# EAGLE design EthernetBoardPanel (EAGLE 6.1)
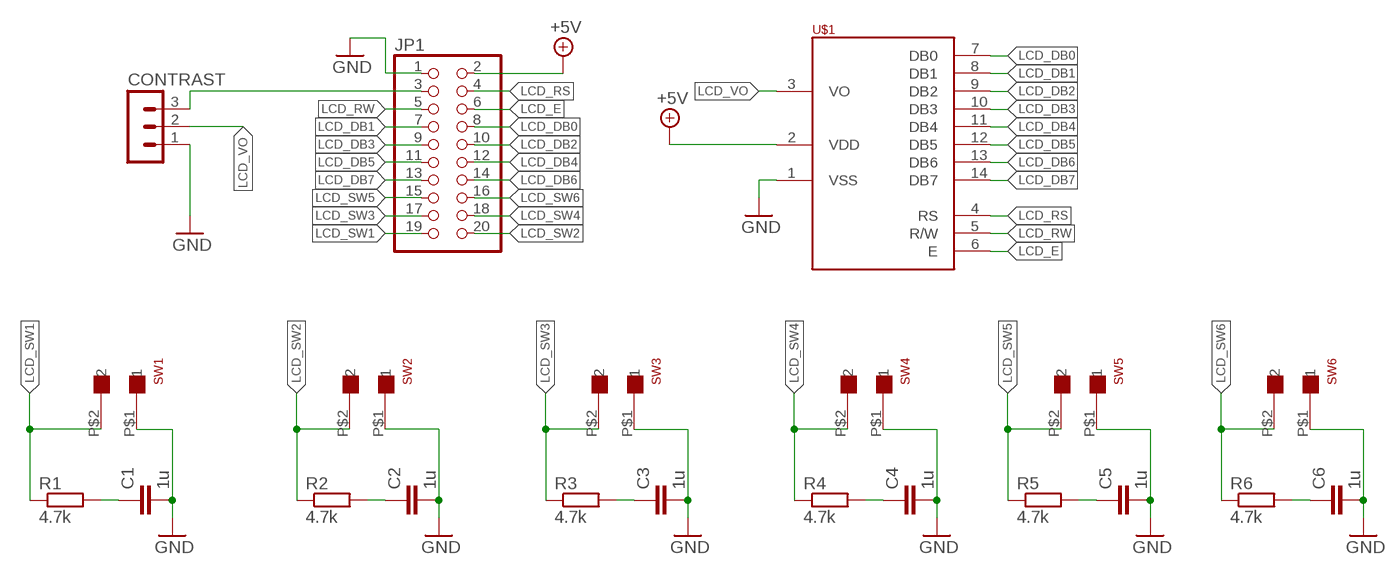
[diagram p0: schematic, sheet 1]

## Parts
C1  1u  C-EU025-025X050  [C025-025X050]
C2  1u  C-EU025-025X050  [C025-025X050]
C3  1u  C-EU025-025X050  [C025-025X050]
C4  1u  C-EU025-025X050  [C025-025X050]
C5  1u  C-EU025-025X050  [C025-025X050]
C6  1u  C-EU025-025X050  [C025-025X050]
CONTRAST  MA03-1  [MA03-1]
JP1  PINHD-2X10  [2X10]
R1  4.7k  R-EU_0204/7  [0204/7]
R2  4.7k  R-EU_0204/7  [0204/7]
R3  4.7k  R-EU_0204/7  [0204/7]
R4  4.7k  R-EU_0204/7  [0204/7]
R5  4.7k  R-EU_0204/7  [0204/7]
R6  4.7k  R-EU_0204/7  [0204/7]
SW1  XH-2  [XH-2]
SW2  XH-2  [XH-2]
SW3  XH-2  [XH-2]
SW4  XH-2  [XH-2]
SW5  XH-2  [XH-2]
SW6  XH-2  [XH-2]
U$1  SC2004  [SC2004]

## Nets
+5V [supply_5v]: JP1.2 U$1.2(VDD)
GND [gnd]: C1.2 C2.2 C3.2 C4.2 C5.2 C6.2 CONTRAST.1 JP1.1 SW1.P$1 SW2.P$1 SW3.P$1 SW4.P$1 SW5.P$1 SW6.P$1 U$1.1(VSS)
LCD_DB0: JP1.8 U$1.7(DB0)
LCD_DB1: JP1.7 U$1.8(DB1)
LCD_DB2: JP1.10 U$1.9(DB2)
LCD_DB3: JP1.9 U$1.10(DB3)
LCD_DB4: JP1.12 U$1.11(DB4)
LCD_DB5: JP1.11 U$1.12(DB5)
LCD_DB6: JP1.14 U$1.13(DB6)
LCD_DB7: JP1.13 U$1.14(DB7)
LCD_E: JP1.6 U$1.6(E)
LCD_RS: JP1.4 U$1.4(RS)
LCD_RW: JP1.5 U$1.5(R/W)
LCD_SW1: JP1.19 R1.1 SW1.P$2
LCD_SW2: JP1.20 R2.1 SW2.P$2
LCD_SW3: JP1.17 R3.1 SW3.P$2
LCD_SW4: JP1.18 R4.1 SW4.P$2
LCD_SW5: JP1.15 R5.1 SW5.P$2
LCD_SW6: JP1.16 R6.1 SW6.P$2
LCD_VO: CONTRAST.2 U$1.3(VO)
N$1: CONTRAST.3 JP1.3
N$2: C5.1 R5.2
N$3: C2.1 R2.2
N$4: C3.1 R3.2
N$5: C4.1 R4.2
N$6: C1.1 R1.2
N$7: C6.1 R6.2

## Library data of the parts
C1-C6 = rcl:C-EU: CAPACITOR, European symbol
CONTRAST = con-lstb:MA03-1: PIN HEADER; OC_FARNELL: unknown; OC_NEWARK: unknown
JP1 = pinhead:PINHD-2X10: PIN HEADER
R1-R6 = rcl:R-EU_: RESISTOR, European symbol
SW1-SW6 = myparts:XH-2
U$1 = myparts:SC2004

## Net classes
1 5v: width 0.508 mm
2 supply_5v: width 1.27 mm, drill 0.508 mm, clearance 0.508 mm
4 gnd: width 0.254 mm, drill 1.016 mm

## Board
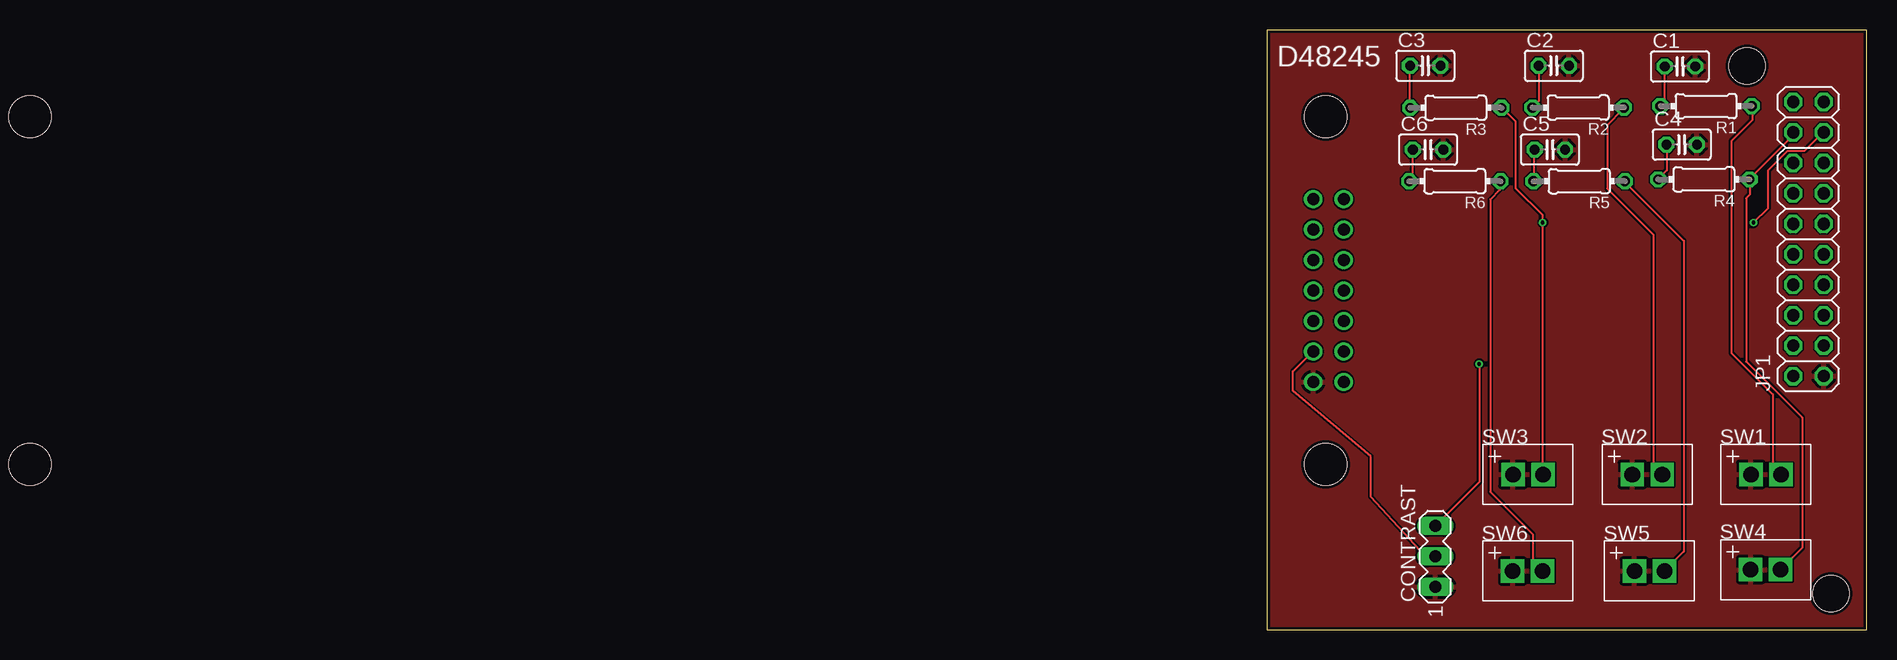
[diagram p1: board, top side]
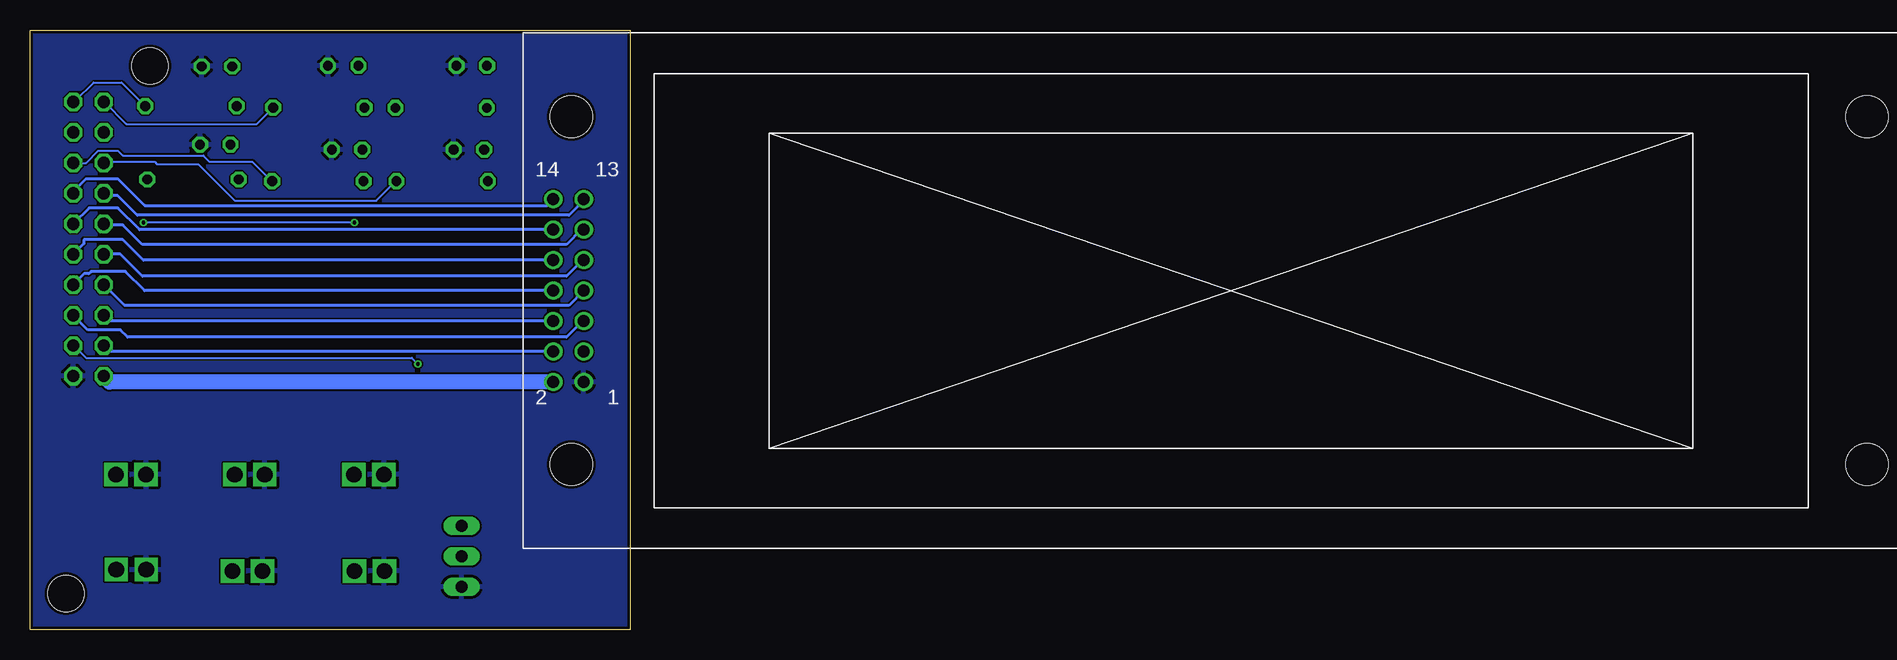
[diagram p2: board, bottom side, seen from below]

Size 50 x 50 mm. Coordinates in mm from the lower left corner, seen from the top.
Outline: 0,0 50,0 50,50 0,50 0,0
Copper layers (1*16): Top 0.035mm / dielectric 1.5mm / Bottom 0.035mm
Design rules: minimum track width 6mil, minimum drill 12mil, track to track 6mil, track to pad 6mil, pad to pad 6mil, via to via 6mil, smd to smd 0mil, copper to edge 10mil, drill to drill 10mil, minimum pad ring 10mil, minimum via ring 6mil, stop-mask expansion 2mil, vias tented up to drill 100mil, thermal gap 10mil
Holes 3 mm at 40,47 47,3

### Footprints (pad centres in the part's own frame; a part is rotated, then mirrored left to right if it is on the bottom)
C025-025X050 = drill 0.813 octagon: 1 -1.27,0; 2 1.27,0
MA03-1 = drill 1.016 long: 1 -2.54,0; 2 0,0; 3 2.54,0
2X10 = drill 1.016 octagon: 1 -11.43,-1.27; 2 -11.43,1.27; 3 -8.89,-1.27; 4 -8.89,1.27; 5 -6.35,-1.27; 6 -6.35,1.27; 7 -3.81,-1.27; 8 -3.81,1.27; 9 -1.27,-1.27; 10 -1.27,1.27; 11 1.27,-1.27; 12 1.27,1.27; 13 3.81,-1.27; 14 3.81,1.27; 15 6.35,-1.27; 16 6.35,1.27; 17 8.89,-1.27; 18 8.89,1.27; 19 11.43,-1.27; 20 11.43,1.27
0204/7 = drill 0.813 octagon: 1 -3.81,0; 2 3.81,0
XH-2 = drill 1.3 square: P$1 -2.5,0; P$2 0,0
SC2004 = drill 1: 1 5.04,13.88; 2 2.5,13.88; 3 5.04,16.42; 4 2.5,16.42; 5 5.04,18.96; 6 2.5,18.96; 7 5.04,21.5; 8 2.5,21.5; 9 5.04,24.04; 10 2.5,24.04; 11 5.04,26.58; 12 2.5,26.58; 13 5.04,29.12; 14 2.5,29.12 | hole 3.5: 4,36; 4,7; 112,7; 112,36

### Placement (x,y rotation side)
C1  34.41,46.96 0 top
C2  23.89,47.01 0 top
C3  13.18,47.02 0 top
C4  34.56,40.44 0 top
C5  23.57,40.03 0 top
C6  13.41,40.03 0 top
CONTRAST  14.02,6.1 90 top
JP1  45.12,32.57 90 top
R1  36.58,43.65 180 top
R2  25.93,43.53 180 top
R3  15.73,43.51 180 top
R4  36.41,37.54 180 top
R5  26.01,37.39 180 top
R6  15.65,37.39 180 top
SW1  42.82,12.92 0 top
SW2  32.94,12.92 0 top
SW3  22.99,12.92 0 top
SW4  42.81,5 0 top
SW5  33.12,4.88 0 top
SW6  22.96,4.88 0 top
U$1  8.88,6.76 0 bottom

### Tracks (layer width: path | path; a pad name or v marks a point on that pad's centre or on a via)
+5V
  Bottom 1.27: U$1.2 43.36,20.64 JP1.2
GND
  pour Bottom: 2.24,51.21 -1.83,50.8 -1.63,-3.25 55.88,-2.44 55.68,50.19
  pour Top: -0.41,50.39 -0.61,-1.22 51,-0.61 50.39,50.8
LCD_DB0
  Bottom 0.254: U$1.7 5.08,27.03 42.12,27.03 JP1.8
LCD_DB1
  Bottom 0.254: U$1.8 40.46,28.27 42.06,29.87 44.91,29.87 45.11,29.67 45.48,29.67 JP1.7
LCD_DB2
  Bottom 0.254: U$1.9 3.94,30.8 5.28,29.46 40.64,29.46 42.47,31.29 JP1.10
LCD_DB3
  Bottom 0.254: U$1.10 40.56,30.8 42.27,32.51 45.52,32.51 45.52,32.17 JP1.9
LCD_DB4
  Bottom 0.254: U$1.11 4.04,33.34 5.28,32.11 40.64,32.11 42.27,33.73 43.75,33.73 JP1.12
LCD_DB5
  Bottom 0.254: U$1.12 40.86,33.34 42.67,35.15 45.07,35.15 JP1.11
LCD_DB6
  Bottom 0.254: U$1.13 3.84,35.79 5.08,34.54 41.05,34.54 42.67,36.17 43.65,36.17 JP1.14
LCD_DB7
  Bottom 0.254: JP1.13 46.39,36.51 45.31,37.59 42.67,37.59 40.44,35.36 6.91,35.36 U$1.14
LCD_E
  Bottom 0.254: U$1.6 43.36,25.73 JP1.6
LCD_RS
  Bottom 0.254: U$1.4 43.36,23.18 JP1.4
LCD_RW
  Bottom 0.254: U$1.5 3.94,25.73 5.28,24.38 41.86,24.38 42.47,24.99 45.17,24.99 JP1.5
LCD_SW1
  Top 0.152: SW1.P$2 42.77,13.01 42.16,13.61 42.16,19.61 38.71,23.06 38.71,40.74 40.44,42.47 40.44,43.59 R1.1
  Bottom 0.152: R1.1 40.44,43.69 42.37,45.62 44.7,45.62 46.23,44.09 46.33,44.09 JP1.19
LCD_SW2
  Top 0.152: SW2.P$2 32.92,13.01 32.21,13.72 32.21,32.92 28.35,36.78 28.35,42.06 29.67,43.38 29.67,43.48 R2.1
  Bottom 0.152: R2.1 29.77,43.48 31.09,42.16 41.96,42.16 43.79,43.99 JP1.20
LCD_SW3  (via drill 0.3)
  Top 0.152: R3.1 19.61,43.48 20.73,42.37 20.73,36.78 22.96,34.54 v22.96,33.93 22.96,13.01 SW3.P$2 | v40.54,33.93 41.76,35.15 41.76,38.3 43.38,39.93 44.81,39.93 46.33,41.45 JP1.17
  Bottom 0.152: v22.96,33.93 v40.54,33.93
LCD_SW4
  Top 0.152: JP1.18 43.79,41.45 43.79,41.15 40.23,37.59 R4.1 40.23,37.49 40.23,36.27 39.93,35.97 39.93,22.35 44.6,17.68 44.6,6.81 42.88,5.08 SW4.P$2
LCD_SW5
  Top 0.152: SW5.P$2 34.75,6.5 34.75,32.41 29.87,37.29 29.87,37.39 R5.1
  Bottom 0.152: R5.1 29.87,37.39 31.5,39.01 35.05,39.01 35.56,39.52 42.27,39.52 42.67,39.93 44.3,39.93 45.31,38.91 46.33,38.91 JP1.15
LCD_SW6
  Top 0.152: SW6.P$2 22.15,5.69 22.15,7.92 18.59,11.48 18.59,35.87 19.41,36.68 19.41,37.39 R6.1
  Bottom 0.152: R6.1 19.51,37.39 21.13,35.76 32.92,35.76 35.97,38.81 39.42,38.81 39.62,39.01 43.79,39.01 JP1.16
LCD_VO
  Top 0.152: CONTRAST.2 13.21,6.1 8.64,11.07 8.64,14.43 2.13,19.91 2.13,21.54 3.76,23.16 U$1.3
N$1  (via drill 0.3)
  Top 0.152: CONTRAST.3 17.68,12.29 v17.68,22.15
  Bottom 0.152: v17.68,22.15 18.19,22.66 45.31,22.66 46.33,23.67 JP1.3
N$2
  Top 0.152: R5.2 22.25,37.39 22.25,40.03 C5.1
N$3
  Top 0.152: R2.2 22.15,43.59 22.66,44.09 22.66,46.94 C2.1
N$4
  Top 0.152: C3.1 11.89,46.94 11.89,43.59 R3.2
N$5
  Top 0.152: R4.2 32.61,37.59 33.33,38.3 33.33,40.44 C4.1
N$6
  Top 0.152: R1.2 32.82,43.69 33.12,43.99 33.12,46.94 C1.1
N$7
  Top 0.152: R6.2 11.89,37.39 12.09,37.59 12.09,40.03 C6.1

### Text on the board
tNames: D48245